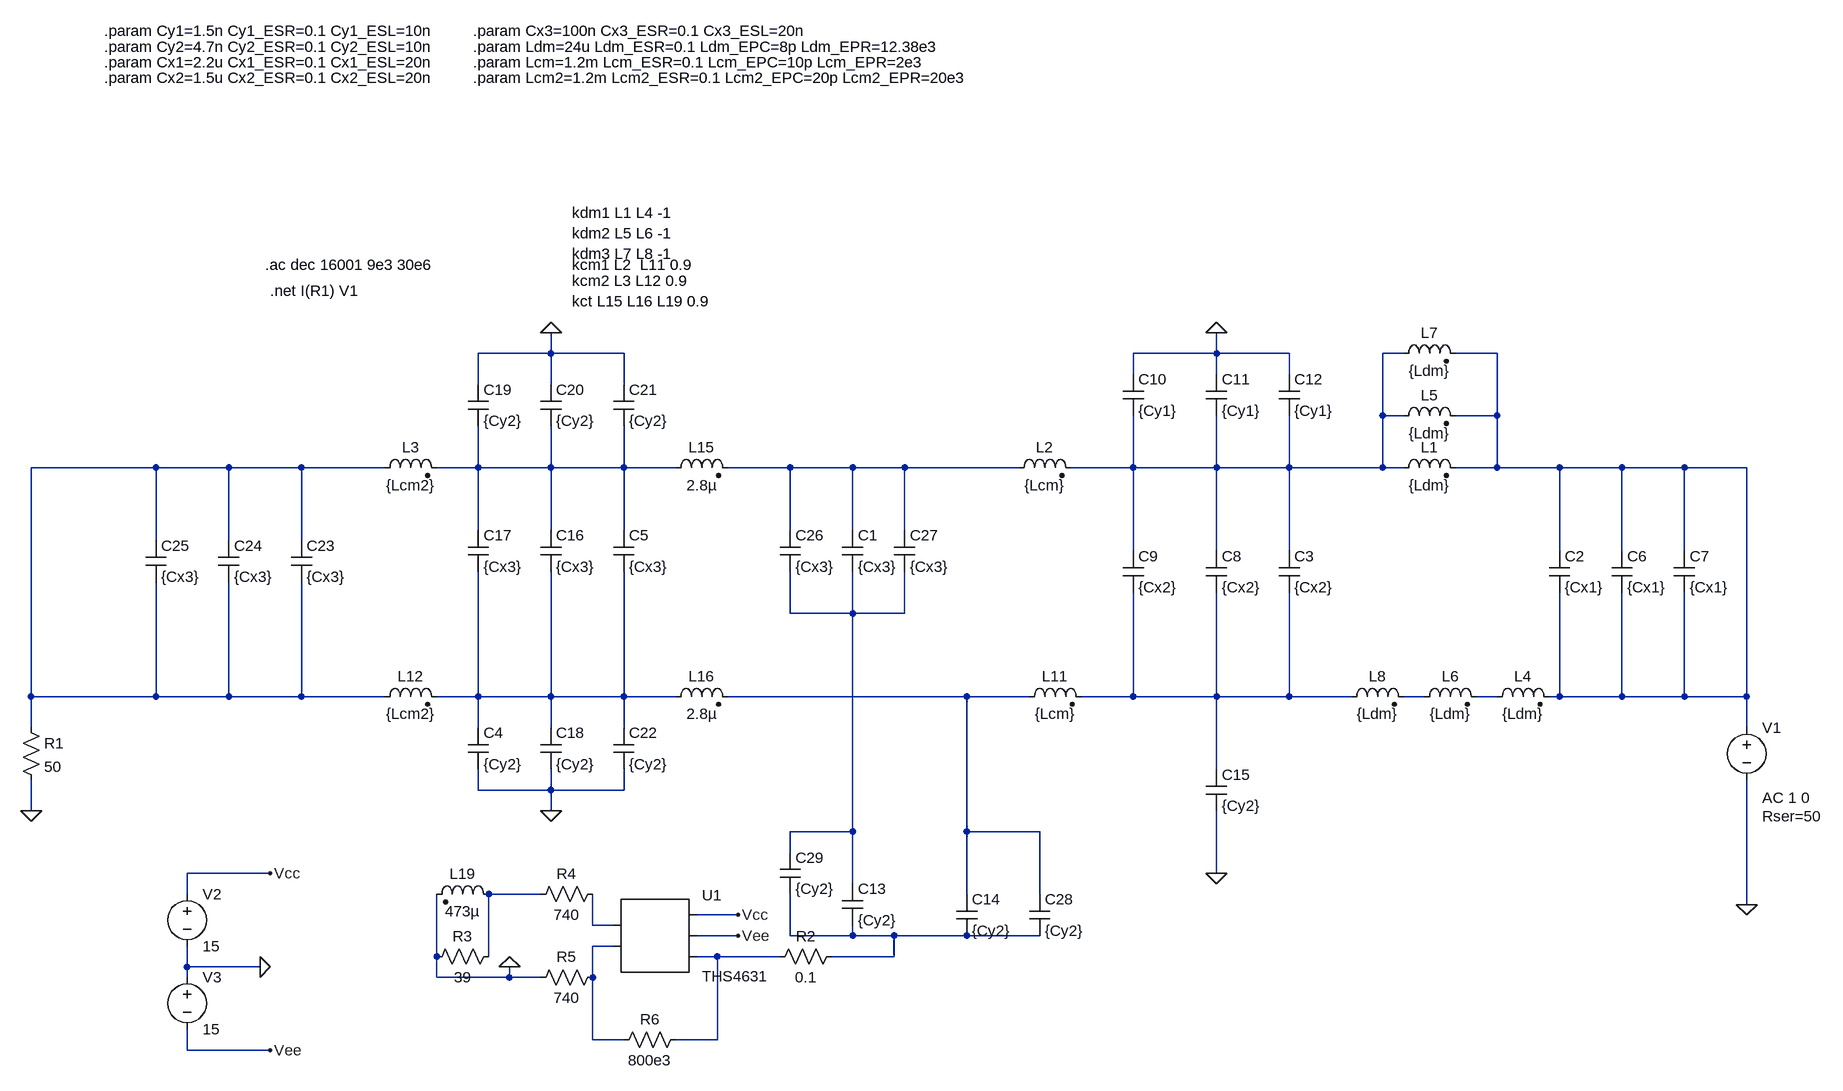
[diagram p0: schematic Simulation_HEF_1phase.asc]
Simulation_HEF_1phase.asc, the LTspice schematic file:
Version 4
SHEET 1 1792 1872
WIRE -496 -192 -496 -224
WIRE -496 -192 -608 -192
WIRE -384 -192 -496 -192
WIRE 528 -192 528 -224
WIRE 528 -192 400 -192
WIRE 640 -192 528 -192
WIRE 816 -192 784 -192
WIRE 960 -192 896 -192
WIRE 400 -160 400 -192
WIRE 528 -160 528 -192
WIRE 640 -160 640 -192
WIRE -608 -144 -608 -192
WIRE -496 -144 -496 -192
WIRE -384 -144 -384 -192
WIRE 784 -96 784 -192
WIRE 816 -96 784 -96
WIRE 960 -96 960 -192
WIRE 960 -96 896 -96
WIRE -1104 -16 -1296 -16
WIRE -992 -16 -1104 -16
WIRE -880 -16 -992 -16
WIRE -752 -16 -880 -16
WIRE -608 -16 -608 -80
WIRE -608 -16 -672 -16
WIRE -496 -16 -496 -80
WIRE -496 -16 -608 -16
WIRE -384 -16 -384 -80
WIRE -384 -16 -496 -16
WIRE -304 -16 -384 -16
WIRE -128 -16 -224 -16
WIRE -32 -16 -128 -16
WIRE 48 -16 -32 -16
WIRE 224 -16 48 -16
WIRE 400 -16 400 -96
WIRE 400 -16 304 -16
WIRE 528 -16 528 -96
WIRE 528 -16 400 -16
WIRE 640 -16 640 -96
WIRE 640 -16 528 -16
WIRE 784 -16 784 -96
WIRE 784 -16 640 -16
WIRE 816 -16 784 -16
WIRE 960 -16 960 -96
WIRE 960 -16 896 -16
WIRE 1056 -16 960 -16
WIRE 1152 -16 1056 -16
WIRE 1248 -16 1152 -16
WIRE 1344 -16 1248 -16
WIRE -608 80 -608 -16
WIRE -496 80 -496 -16
WIRE -384 80 -384 -16
WIRE -128 80 -128 -16
WIRE -32 80 -32 -16
WIRE 48 80 48 -16
WIRE -1104 96 -1104 -16
WIRE -992 96 -992 -16
WIRE -880 96 -880 -16
WIRE 400 112 400 -16
WIRE 528 112 528 -16
WIRE 640 112 640 -16
WIRE 1056 112 1056 -16
WIRE 1152 112 1152 -16
WIRE 1248 112 1248 -16
WIRE -128 208 -128 144
WIRE -32 208 -32 144
WIRE -32 208 -128 208
WIRE 48 208 48 144
WIRE 48 208 -32 208
WIRE -1296 336 -1296 -16
WIRE -1104 336 -1104 160
WIRE -1104 336 -1296 336
WIRE -992 336 -992 160
WIRE -992 336 -1104 336
WIRE -880 336 -880 160
WIRE -880 336 -992 336
WIRE -752 336 -880 336
WIRE -608 336 -608 144
WIRE -608 336 -672 336
WIRE -496 336 -496 144
WIRE -496 336 -608 336
WIRE -384 336 -384 144
WIRE -384 336 -496 336
WIRE -304 336 -384 336
WIRE 144 336 -224 336
WIRE 240 336 144 336
WIRE 400 336 400 176
WIRE 400 336 320 336
WIRE 528 336 528 176
WIRE 528 336 400 336
WIRE 640 336 640 176
WIRE 640 336 528 336
WIRE 736 336 640 336
WIRE 848 336 816 336
WIRE 960 336 928 336
WIRE 1056 336 1056 176
WIRE 1056 336 1040 336
WIRE 1152 336 1152 176
WIRE 1152 336 1056 336
WIRE 1248 336 1248 176
WIRE 1248 336 1152 336
WIRE 1344 336 1344 -16
WIRE 1344 336 1248 336
WIRE -1296 384 -1296 336
WIRE -608 384 -608 336
WIRE -496 384 -496 336
WIRE -384 384 -384 336
WIRE 1344 384 1344 336
WIRE 528 448 528 336
WIRE -608 480 -608 448
WIRE -496 480 -496 448
WIRE -496 480 -608 480
WIRE -384 480 -384 448
WIRE -384 480 -496 480
WIRE -1296 512 -1296 464
WIRE -496 512 -496 480
WIRE -32 544 -32 208
WIRE -32 544 -128 544
WIRE 144 544 144 336
WIRE 256 544 144 544
WIRE -128 576 -128 544
WIRE -928 608 -1056 608
WIRE 528 608 528 512
WIRE -32 624 -32 544
WIRE -1056 640 -1056 608
WIRE -512 640 -592 640
WIRE 144 640 144 544
WIRE 256 640 256 544
WIRE 1344 656 1344 464
WIRE -208 672 -272 672
WIRE -432 688 -432 640
WIRE -400 688 -432 688
WIRE -208 704 -272 704
WIRE -128 704 -128 640
WIRE -32 704 -32 688
WIRE -32 704 -128 704
WIRE 32 704 -32 704
WIRE 144 704 32 704
WIRE 256 704 144 704
WIRE -400 720 -432 720
WIRE -672 736 -672 640
WIRE -592 736 -592 640
WIRE -240 736 -272 736
WIRE -144 736 -240 736
WIRE 32 736 32 704
WIRE 32 736 -64 736
WIRE -1056 752 -1056 720
WIRE -944 752 -1056 752
WIRE -1056 768 -1056 752
WIRE -672 768 -672 736
WIRE -560 768 -560 752
WIRE -560 768 -672 768
WIRE -512 768 -560 768
WIRE -432 768 -432 720
WIRE -432 864 -432 768
WIRE -384 864 -432 864
WIRE -240 864 -240 736
WIRE -240 864 -304 864
WIRE -1056 880 -1056 848
WIRE -928 880 -1056 880
FLAG 528 608 0
FLAG 528 -224 0
FLAG -496 -224 0
FLAG -496 512 0
FLAG -1296 512 0
FLAG 1344 656 0
FLAG -560 752 0
FLAG -944 752 0
FLAG -928 608 Vcc
FLAG -928 880 Vee
FLAG -208 672 Vcc
FLAG -208 704 Vee
SYMBOL ind2 800 0 R270
WINDOW 0 32 56 VTop 2
WINDOW 3 5 56 VBottom 2
SYMATTR InstName L1
SYMATTR Value {Ldm}
SYMATTR Type ind
SYMATTR SpiceLine Rser={Ldm_ESR} Rpar={Ldm_EPR} Cpar={Ldm_EPC}
SYMBOL cap 1040 112 R0
SYMATTR InstName C2
SYMATTR Value {Cx1}
SYMATTR SpiceLine Rser={Cx1_ESR} Lser={Cx1_ESL}
SYMBOL cap 624 112 R0
SYMATTR InstName C3
SYMATTR Value {Cx2}
SYMATTR SpiceLine Rser={Cx2_ESR} Lser={Cx2_ESL}
SYMBOL ind2 208 0 R270
WINDOW 0 32 56 VTop 2
WINDOW 3 5 56 VBottom 2
SYMATTR InstName L2
SYMATTR Value {Lcm}
SYMATTR Type ind
SYMATTR SpiceLine Rser={Lcm_ESR} Rpar={Lcm_EPR} Cpar={Lcm_EPC}
SYMBOL ind2 -768 0 R270
WINDOW 0 32 56 VTop 2
WINDOW 3 5 56 VBottom 2
SYMATTR InstName L3
SYMATTR Value {Lcm2}
SYMATTR Type ind
SYMATTR SpiceLine Rser={Lcm2_ESR} Rpar={Lcm2_EPR} Cpar={Lcm2_EPC}
SYMBOL cap -624 384 R0
SYMATTR InstName C4
SYMATTR Value {Cy2}
SYMATTR SpiceLine Rser={Cy2_ESR} Lser={Cy2_ESL}
SYMBOL cap -400 80 R0
SYMATTR InstName C5
SYMATTR Value {Cx3}
SYMATTR SpiceLine Rser={Cx3_ESR} Lser={Cx3_ESL}
SYMBOL cap 1136 112 R0
SYMATTR InstName C6
SYMATTR Value {Cx1}
SYMATTR SpiceLine Rser={Cx1_ESR} Lser={Cx1_ESL}
SYMBOL cap 1232 112 R0
SYMATTR InstName C7
SYMATTR Value {Cx1}
SYMATTR SpiceLine Rser={Cx1_ESR} Lser={Cx1_ESL}
SYMBOL ind2 944 352 R270
WINDOW 0 32 56 VTop 2
WINDOW 3 5 56 VBottom 2
SYMATTR InstName L4
SYMATTR Value {Ldm}
SYMATTR Type ind
SYMATTR SpiceLine Rser={Ldm_ESR} Rpar={Ldm_EPR} Cpar={Ldm_EPC}
SYMBOL ind2 832 352 R270
WINDOW 0 32 56 VTop 2
WINDOW 3 5 56 VBottom 2
SYMATTR InstName L6
SYMATTR Value {Ldm}
SYMATTR Type ind
SYMATTR SpiceLine Rser={Ldm_ESR} Rpar={Ldm_EPR} Cpar={Ldm_EPC}
SYMBOL ind2 720 352 R270
WINDOW 0 32 56 VTop 2
WINDOW 3 5 56 VBottom 2
SYMATTR InstName L8
SYMATTR Value {Ldm}
SYMATTR Type ind
SYMATTR SpiceLine Rser={Ldm_ESR} Rpar={Ldm_EPR} Cpar={Ldm_EPC}
SYMBOL cap 512 112 R0
SYMATTR InstName C8
SYMATTR Value {Cx2}
SYMATTR SpiceLine Rser={Cx2_ESR} Lser={Cx2_ESL}
SYMBOL cap 384 112 R0
SYMATTR InstName C9
SYMATTR Value {Cx2}
SYMATTR SpiceLine Rser={Cx2_ESR} Lser={Cx2_ESL}
SYMBOL ind2 224 352 R270
WINDOW 0 32 56 VTop 2
WINDOW 3 5 56 VBottom 2
SYMATTR InstName L11
SYMATTR Value {Lcm}
SYMATTR Type ind
SYMATTR SpiceLine Rser={Lcm_ESR} Rpar={Lcm_EPR} Cpar={Lcm_EPC}
SYMBOL cap 384 -160 R0
SYMATTR InstName C10
SYMATTR Value {Cy1}
SYMATTR SpiceLine Rser={Cy1_ESR} Lser={Cy1_ESL}
SYMBOL cap 512 -160 R0
SYMATTR InstName C11
SYMATTR Value {Cy1}
SYMATTR SpiceLine Rser={Cy1_ESR} Lser={Cy1_ESL}
SYMBOL cap 624 -160 R0
SYMATTR InstName C12
SYMATTR Value {Cy1}
SYMATTR SpiceLine Rser={Cy1_ESR} Lser={Cy1_ESL}
SYMBOL cap 512 448 R0
SYMATTR InstName C15
SYMATTR Value {Cy2}
SYMATTR SpiceLine Rser={Cy1_ESR} Lser={Cy1_ESL}
SYMBOL cap -512 80 R0
SYMATTR InstName C16
SYMATTR Value {Cx3}
SYMATTR SpiceLine Rser={Cx3_ESR} Lser={Cx3_ESL}
SYMBOL cap -624 80 R0
SYMATTR InstName C17
SYMATTR Value {Cx3}
SYMATTR SpiceLine Rser={Cx3_ESR} Lser={Cx3_ESL}
SYMBOL ind2 -768 352 R270
WINDOW 0 32 56 VTop 2
WINDOW 3 5 56 VBottom 2
SYMATTR InstName L12
SYMATTR Value {Lcm2}
SYMATTR Type ind
SYMATTR SpiceLine Rser={Lcm2_ESR} Rpar={Lcm2_EPR} Cpar={Lcm2_EPC}
SYMBOL cap -512 384 R0
SYMATTR InstName C18
SYMATTR Value {Cy2}
SYMATTR SpiceLine Rser={Cy2_ESR} Lser={Cy2_ESL}
SYMBOL cap -624 -144 R0
SYMATTR InstName C19
SYMATTR Value {Cy2}
SYMATTR SpiceLine Rser={Cy2_ESR} Lser={Cy2_ESL}
SYMBOL cap -512 -144 R0
SYMATTR InstName C20
SYMATTR Value {Cy2}
SYMATTR SpiceLine Rser={Cy2_ESR} Lser={Cy2_ESL}
SYMBOL cap -400 -144 R0
SYMATTR InstName C21
SYMATTR Value {Cy2}
SYMATTR SpiceLine Rser={Cy2_ESR} Lser={Cy2_ESL}
SYMBOL cap -400 384 R0
SYMATTR InstName C22
SYMATTR Value {Cy2}
SYMATTR SpiceLine Rser={Cy2_ESR} Lser={Cy2_ESL}
SYMBOL cap -896 96 R0
SYMATTR InstName C23
SYMATTR Value {Cx3}
SYMATTR SpiceLine Rser={Cx3_ESR} Lser={Cx3_ESL}
SYMBOL cap -1008 96 R0
SYMATTR InstName C24
SYMATTR Value {Cx3}
SYMATTR SpiceLine Rser={Cx3_ESR} Lser={Cx3_ESL}
SYMBOL cap -1120 96 R0
SYMATTR InstName C25
SYMATTR Value {Cx3}
SYMATTR SpiceLine Rser={Cx3_ESR} Lser={Cx3_ESL}
SYMBOL voltage 1344 368 R0
WINDOW 123 24 124 Left 2
WINDOW 39 24 152 Left 2
SYMATTR Value2 AC 1 0
SYMATTR SpiceLine Rser=50
SYMATTR InstName V1
SYMATTR Value ""
SYMBOL res -1312 368 R0
SYMATTR InstName R1
SYMATTR Value 50
SYMBOL cap -144 80 R0
SYMATTR InstName C26
SYMATTR Value {Cx3}
SYMATTR SpiceLine Rser={Cx3_ESR} Lser={Cx3_ESL}
SYMBOL cap -48 80 R0
SYMATTR InstName C1
SYMATTR Value {Cx3}
SYMATTR SpiceLine Rser={Cx3_ESR} Lser={Cx3_ESL}
SYMBOL cap 32 80 R0
SYMATTR InstName C27
SYMATTR Value {Cx3}
SYMATTR SpiceLine Rser={Cx3_ESR} Lser={Cx3_ESL}
SYMBOL AutoGenerated\\THS4631 -336 704 R0
SYMATTR InstName U1
SYMBOL res -48 720 R90
WINDOW 0 0 56 VBottom 2
WINDOW 3 32 56 VTop 2
SYMATTR InstName R2
SYMATTR Value 0.1
SYMBOL ind2 -320 0 R270
WINDOW 0 32 56 VTop 2
WINDOW 3 5 56 VBottom 2
SYMATTR InstName L15
SYMATTR Value 2.8µ
SYMATTR Type ind
SYMBOL ind2 -320 352 R270
WINDOW 0 32 56 VTop 2
WINDOW 3 5 56 VBottom 2
SYMATTR InstName L16
SYMATTR Value 2.8µ
SYMATTR Type ind
SYMBOL ind2 -576 656 M270
WINDOW 0 32 56 VTop 2
WINDOW 3 5 56 VBottom 2
SYMATTR InstName L19
SYMATTR Value 473µ
SYMATTR Type ind
SYMATTR SpiceLine Rpar=10e3 Cpar=1e-12
SYMBOL res -576 720 R90
WINDOW 0 0 56 VBottom 2
WINDOW 3 32 56 VTop 2
SYMATTR InstName R3
SYMATTR Value 39
SYMBOL res -416 624 R90
WINDOW 0 0 56 VBottom 2
WINDOW 3 32 56 VTop 2
SYMATTR InstName R4
SYMATTR Value 740
SYMBOL res -416 752 R90
WINDOW 0 0 56 VBottom 2
WINDOW 3 32 56 VTop 2
SYMATTR InstName R5
SYMATTR Value 740
SYMBOL res -288 848 R90
WINDOW 0 0 56 VBottom 2
WINDOW 3 32 56 VTop 2
SYMATTR InstName R6
SYMATTR Value 800e3
SYMBOL voltage -1056 624 R0
WINDOW 123 0 0 Left 0
WINDOW 39 0 0 Left 0
SYMATTR InstName V2
SYMATTR Value 15
SYMBOL voltage -1056 752 R0
WINDOW 123 0 0 Left 0
WINDOW 39 0 0 Left 0
SYMATTR InstName V3
SYMATTR Value 15
SYMBOL ind2 800 -80 R270
WINDOW 0 32 56 VTop 2
WINDOW 3 5 56 VBottom 2
SYMATTR InstName L5
SYMATTR Value {Ldm}
SYMATTR Type ind
SYMATTR SpiceLine Rser={Ldm_ESR} Rpar={Ldm_EPR} Cpar={Ldm_EPC}
SYMBOL ind2 800 -176 R270
WINDOW 0 32 56 VTop 2
WINDOW 3 5 56 VBottom 2
SYMATTR InstName L7
SYMATTR Value {Ldm}
SYMATTR Type ind
SYMATTR SpiceLine Rser={Ldm_ESR} Rpar={Ldm_EPR} Cpar={Ldm_EPC}
SYMBOL cap -48 624 R0
SYMATTR InstName C13
SYMATTR Value {Cy2}
SYMATTR SpiceLine Rser={Cy1_ESR} Lser={Cy1_ESL}
SYMBOL cap 128 640 R0
SYMATTR InstName C14
SYMATTR Value {Cy2}
SYMATTR SpiceLine Rser={Cy1_ESR} Lser={Cy1_ESL}
SYMBOL cap 240 640 R0
SYMATTR InstName C28
SYMATTR Value {Cy2}
SYMATTR SpiceLine Rser={Cy1_ESR} Lser={Cy1_ESL}
SYMBOL cap -144 576 R0
SYMATTR InstName C29
SYMATTR Value {Cy2}
SYMATTR SpiceLine Rser={Cy1_ESR} Lser={Cy1_ESL}
TEXT -1184 -664 Left 2 !.param Cy2=4.7n Cy2_ESR=0.1 Cy2_ESL=10n
TEXT -1184 -640 Left 2 !.param Cx1=2.2u Cx1_ESR=0.1 Cx1_ESL=20n
TEXT -1184 -688 Left 2 !.param Cy1=1.5n Cy1_ESR=0.1 Cy1_ESL=10n
TEXT -1184 -616 Left 2 !.param Cx2=1.5u Cx2_ESR=0.1 Cx2_ESL=20n
TEXT -616 -688 Left 2 !.param Cx3=100n Cx3_ESR=0.1 Cx3_ESL=20n
TEXT -616 -664 Left 2 !.param Ldm=24u Ldm_ESR=0.1 Ldm_EPC=8p Ldm_EPR=12.38e3
TEXT -616 -640 Left 2 !.param Lcm=1.2m Lcm_ESR=0.1 Lcm_EPC=10p Lcm_EPR=2e3
TEXT -616 -616 Left 2 !.param Lcm2=1.2m Lcm2_ESR=0.1 Lcm2_EPC=20p Lcm2_EPR=20e3
TEXT -464 -408 Left 2 !kdm1 L1 L4 -1\nkdm2 L5 L6 -1\nkdm3 L7 L8 -1
TEXT -464 -328 Left 2 !kcm1 L2  L11 0.9
TEXT -464 -304 Left 2 !kcm2 L3 L12 0.9
TEXT -928 -288 Left 2 !.net I(R1) V1
TEXT -936 -328 Left 2 !.ac dec 16001 9e3 30e6
TEXT -464 -272 Left 2 !kct L15 L16 L19 0.9

The netlist it stands for:
* Simulation_HEF_1phase.asc
L1 N001 N002 {Ldm} Rser={Ldm_ESR} Rpar={Ldm_EPR} Cpar={Ldm_EPC}
C2 N002 N002 {Cx1} Rser={Cx1_ESR} Lser={Cx1_ESL}
C3 N001 N009 {Cx2} Rser={Cx2_ESR} Lser={Cx2_ESL}
L2 N005 N001 {Lcm} Rser={Lcm_ESR} Rpar={Lcm_EPR} Cpar={Lcm_EPC}
L3 N003 N004 {Lcm2} Rser={Lcm2_ESR} Rpar={Lcm2_EPR} Cpar={Lcm2_EPC}
C4 N007 0 {Cy2} Rser={Cy2_ESR} Lser={Cy2_ESL}
C5 N004 N007 {Cx3} Rser={Cx3_ESR} Lser={Cx3_ESL}
C6 N002 N002 {Cx1} Rser={Cx1_ESR} Lser={Cx1_ESL}
C7 N002 N002 {Cx1} Rser={Cx1_ESR} Lser={Cx1_ESL}
L4 N011 N002 {Ldm} Rser={Ldm_ESR} Rpar={Ldm_EPR} Cpar={Ldm_EPC}
L6 N010 N011 {Ldm} Rser={Ldm_ESR} Rpar={Ldm_EPR} Cpar={Ldm_EPC}
L8 N009 N010 {Ldm} Rser={Ldm_ESR} Rpar={Ldm_EPR} Cpar={Ldm_EPC}
C8 N001 N009 {Cx2} Rser={Cx2_ESR} Lser={Cx2_ESL}
C9 N001 N009 {Cx2} Rser={Cx2_ESR} Lser={Cx2_ESL}
L11 N008 N009 {Lcm} Rser={Lcm_ESR} Rpar={Lcm_EPR} Cpar={Lcm_EPC}
C10 0 N001 {Cy1} Rser={Cy1_ESR} Lser={Cy1_ESL}
C11 0 N001 {Cy1} Rser={Cy1_ESR} Lser={Cy1_ESL}
C12 0 N001 {Cy1} Rser={Cy1_ESR} Lser={Cy1_ESL}
C15 N009 0 {Cy2} Rser={Cy1_ESR} Lser={Cy1_ESL}
C16 N004 N007 {Cx3} Rser={Cx3_ESR} Lser={Cx3_ESL}
C17 N004 N007 {Cx3} Rser={Cx3_ESR} Lser={Cx3_ESL}
L12 N003 N007 {Lcm2} Rser={Lcm2_ESR} Rpar={Lcm2_EPR} Cpar={Lcm2_EPC}
C18 N007 0 {Cy2} Rser={Cy2_ESR} Lser={Cy2_ESL}
C19 0 N004 {Cy2} Rser={Cy2_ESR} Lser={Cy2_ESL}
C20 0 N004 {Cy2} Rser={Cy2_ESR} Lser={Cy2_ESL}
C21 0 N004 {Cy2} Rser={Cy2_ESR} Lser={Cy2_ESL}
C22 N007 0 {Cy2} Rser={Cy2_ESR} Lser={Cy2_ESL}
C23 N003 N003 {Cx3} Rser={Cx3_ESR} Lser={Cx3_ESL}
C24 N003 N003 {Cx3} Rser={Cx3_ESR} Lser={Cx3_ESL}
C25 N003 N003 {Cx3} Rser={Cx3_ESR} Lser={Cx3_ESL}
V1 N002 0 AC 1 0 Rser=50
R1 N003 0 50
C26 N005 N006 {Cx3} Rser={Cx3_ESR} Lser={Cx3_ESL}
C1 N005 N006 {Cx3} Rser={Cx3_ESR} Lser={Cx3_ESL}
C27 N005 N006 {Cx3} Rser={Cx3_ESR} Lser={Cx3_ESL}
* U1: THS4631 (symbol AutoGenerated\THS4631 not available, pins judged from their places): pin1=N013 pin2=N015 pin3=Vcc pin4=Vee pin5=N016
R2 N014 N016 0.1
L15 N004 N005 2.8µ
L16 N007 N008 2.8µ
L19 N012 0 473µ Rpar=10e3 Cpar=1e-12
R3 N012 0 39
R4 N013 N012 740
R5 N015 0 740
R6 N016 N015 800e3
V2 Vcc 0 15
V3 0 Vee 15
L5 N001 N002 {Ldm} Rser={Ldm_ESR} Rpar={Ldm_EPR} Cpar={Ldm_EPC}
L7 N001 N002 {Ldm} Rser={Ldm_ESR} Rpar={Ldm_EPR} Cpar={Ldm_EPC}
C13 N006 N014 {Cy2} Rser={Cy1_ESR} Lser={Cy1_ESL}
C14 N008 N014 {Cy2} Rser={Cy1_ESR} Lser={Cy1_ESL}
C28 N008 N014 {Cy2} Rser={Cy1_ESR} Lser={Cy1_ESL}
C29 N006 N014 {Cy2} Rser={Cy1_ESR} Lser={Cy1_ESL}
.param Cy2=4.7n Cy2_ESR=0.1 Cy2_ESL=10n
.param Cx1=2.2u Cx1_ESR=0.1 Cx1_ESL=20n
.param Cy1=1.5n Cy1_ESR=0.1 Cy1_ESL=10n
.param Cx2=1.5u Cx2_ESR=0.1 Cx2_ESL=20n
.param Cx3=100n Cx3_ESR=0.1 Cx3_ESL=20n
.param Ldm=24u Ldm_ESR=0.1 Ldm_EPC=8p Ldm_EPR=12.38e3
.param Lcm=1.2m Lcm_ESR=0.1 Lcm_EPC=10p Lcm_EPR=2e3
.param Lcm2=1.2m Lcm2_ESR=0.1 Lcm2_EPC=20p Lcm2_EPR=20e3
kdm1 L1 L4 -1
kdm2 L5 L6 -1
kdm3 L7 L8 -1
kcm1 L2  L11 0.9
kcm2 L3 L12 0.9
.net I(R1) V1
.ac dec 16001 9e3 30e6
kct L15 L16 L19 0.9
.backanno
.end